# Altium schematic sheet 窄带滤波60K.SchDoc
size A4
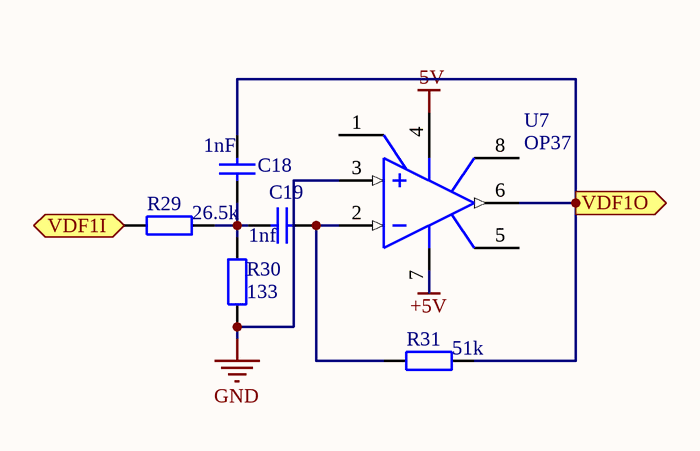
[diagram p0: 窄带滤波60K.SchDoc]

## Parts
C18  瓷片电容  [瓷片电容]  (value not drawn)
C19  瓷片电容  [瓷片电容]  (value not drawn)
R29  value 26.5k  [AXIAL-0.4]  (hidden comment: Res2)
R30  value 133  [AXIAL-0.4]  (hidden comment: Res2)
R31  value 51k  [AXIAL-0.4]  (hidden comment: Res2)
U7  OP37  [N-8_A]

## Ports
VDF1I (in), VDF1O (out)

## Nets
+5V: U7.7(V+)
-5V: U7.4(V-)
GND: R30.1 U7.3(IN+)
VDF1I: R29.1 ; port VDF1I
VDF1O: C18.1 R31.2 U7.6(OUT) ; port VDF1O
NetC18_2: C18.2 C19.2 R29.2 R30.2
NetC19_1: C19.1 R31.1 U7.2(IN-)

Not connected (* = marked no-connect by the designer): U7 1(NULL1) 5(NC) 8(NULL2)

## Notes on the sheet
- 标题
- 日期
- 红外数字模拟接收一体机
- 2015 5 29
- 作者
- 模电组
- 单位
- 电子技术协会
- (in symbol 瓷片电容) 1nf; 1nF

## Library data of the parts
R29-R31 = Res2: Resistor; Published: 8-Jun-2000; LatestRevisionDate: 17-Jul-2002; LatestRevisionNote: Re-released for DXP Platform.; PackageReference: AXIAL-0.4; Publisher: Altium Limited
U7 = ADOP07CN: Ultra-Low Offset Voltage Operational Amplifier; Note: Pin 5 is not connected.; Published: 8-Jun-2000; LatestRevisionDate: 04-Mar-2005; LatestRevisionNote: Stylized 3D Model Added.; DatasheetVersion: 1992; PackageReference: N-8_A; Publisher: Altium Limited; PackageDescription: DIP; 8 Leads; Row Spacing 7.62 mm; Pitch 2.54 mm; Code_JEDEC: MO-001-AN; ComponentLink1Description: Manufacturer Link; ComponentLink1URL: http://www.analog.com/